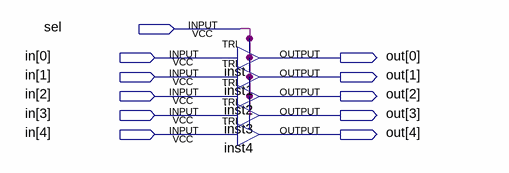
[diagram p0: schematic sheet]
// Quartus schematic tri5.bdf as structural Verilog: 5 symbols, 11 pins
module tri5 (
  input  sel,
  input  [4:0] in,
  output [4:0] out
);

  TRI inst (.IN(in[0]), .OE(sel), .OUT(out[0]));
  TRI inst1 (.IN(in[1]), .OE(sel), .OUT(out[1]));
  TRI inst2 (.IN(in[2]), .OE(sel), .OUT(out[2]));
  TRI inst3 (.IN(in[3]), .OE(sel), .OUT(out[3]));
  TRI inst4 (.IN(in[4]), .OE(sel), .OUT(out[4]));
endmodule
